# Altium schematic sheet [03] Arduino.SchDoc: Arduino Uno socket
size B; DocumentNumber: 3; SheetNumber: 3; SheetTotal: 3; Designators: 1-99; PageSize: B
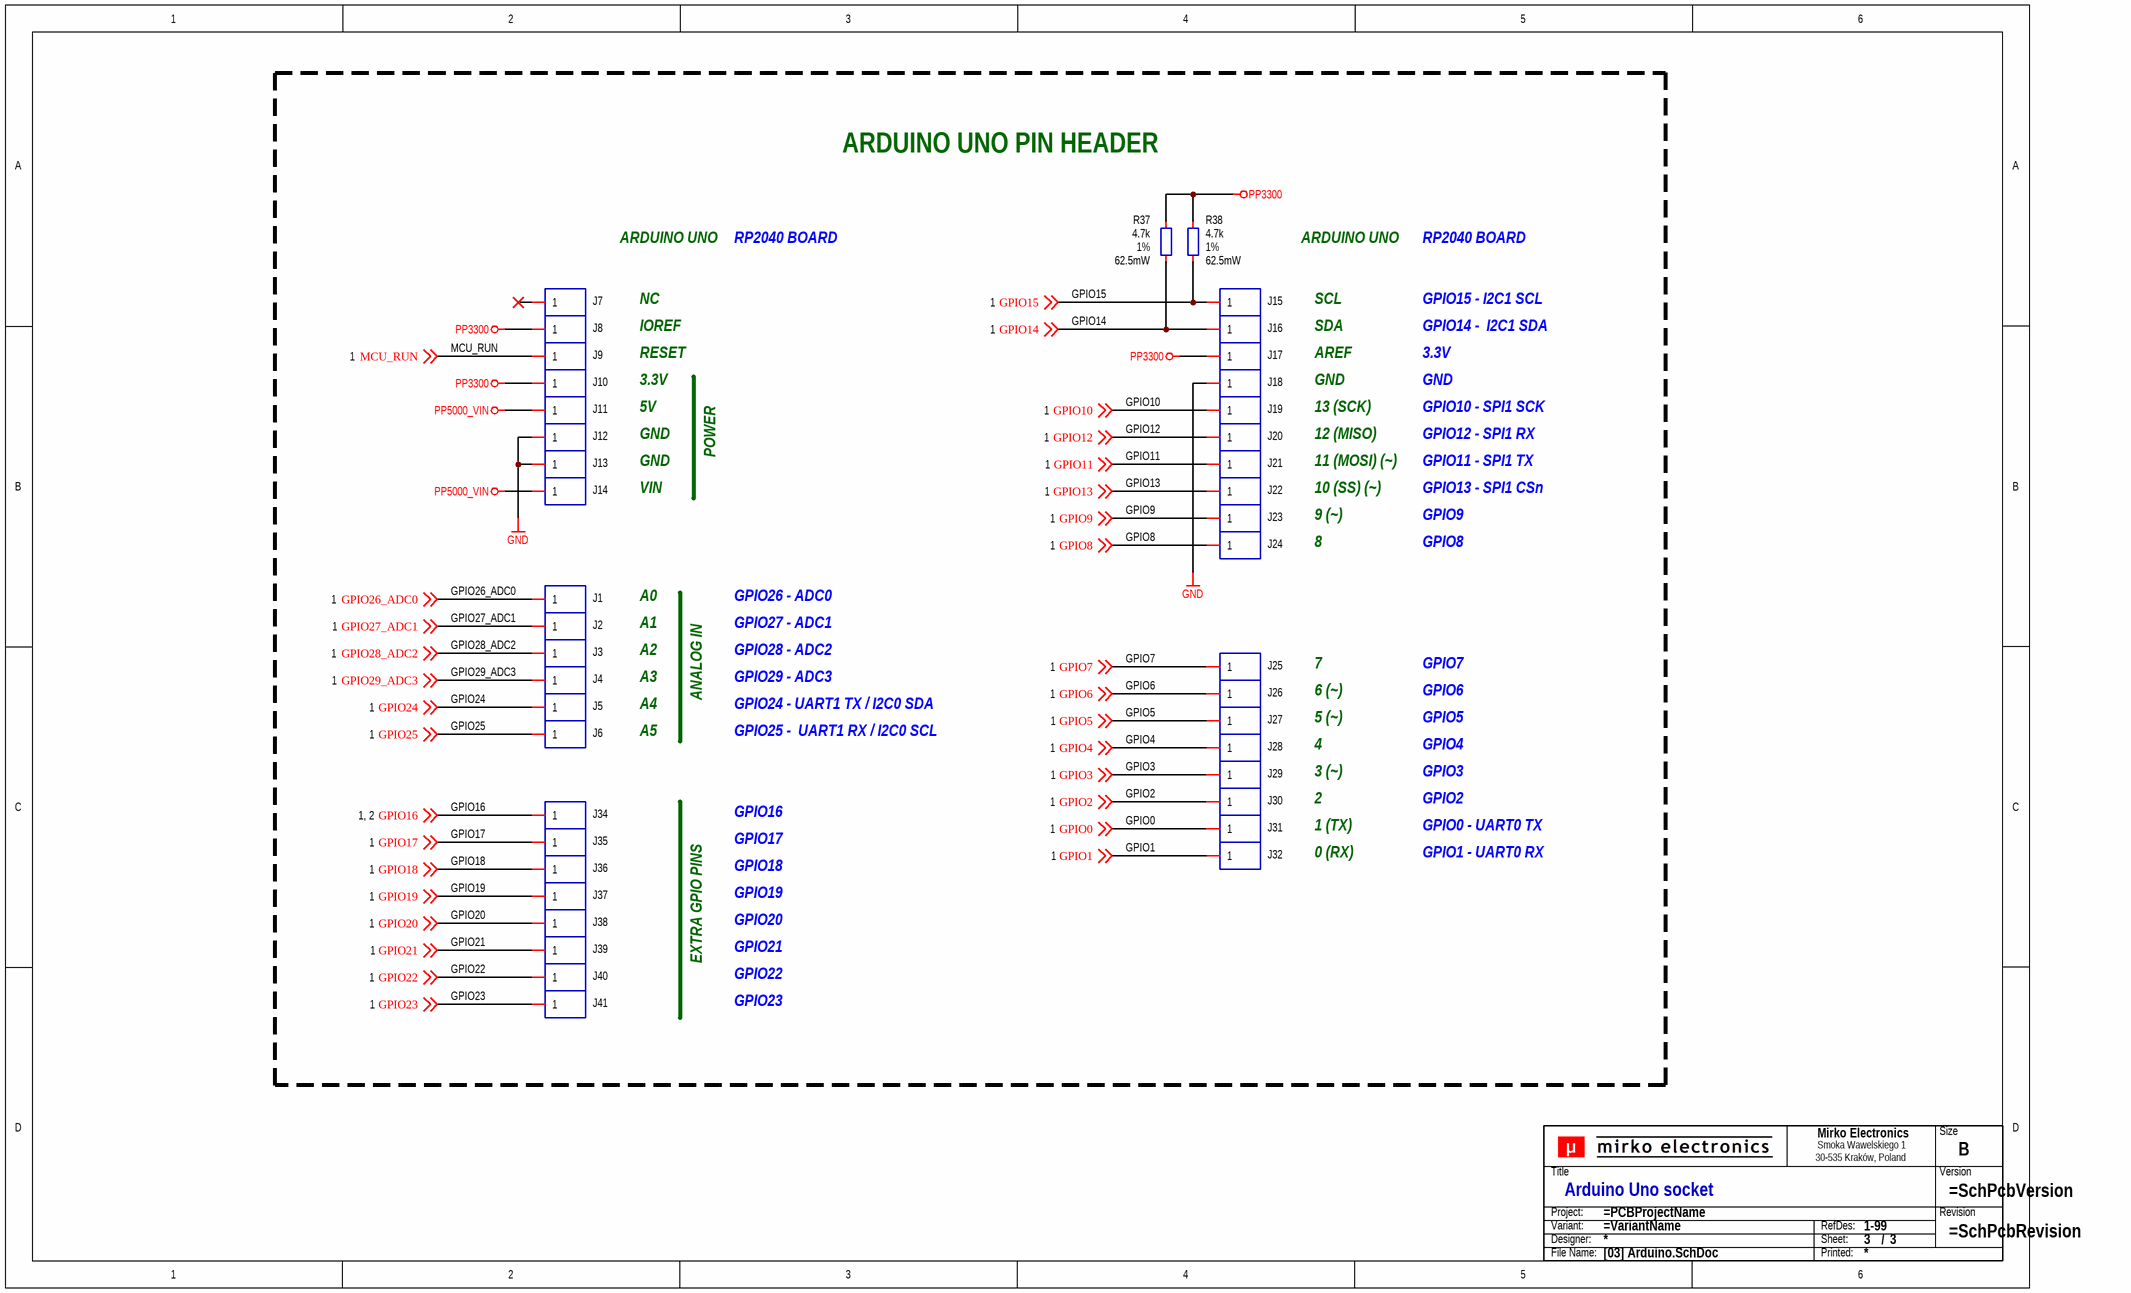
[diagram p0: [03] Arduino.SchDoc]

## Parts
J1  (no value)  [PCB_PAD_THT_280X180H100_RND]  (no BOM)
J2  (no value)  [PCB_PAD_THT_280X180H100_RND]  (no BOM)
J3  (no value)  [PCB_PAD_THT_280X180H100_RND]  (no BOM)
J4  (no value)  [PCB_PAD_THT_280X180H100_RND]  (no BOM)
J5  (no value)  [PCB_PAD_THT_280X180H100_RND]  (no BOM)
J6  (no value)  [PCB_PAD_THT_280X180H100_RND]  (no BOM)
J7  (no value)  [PCB_PAD_THT_280X180H100_RND]  (no BOM)
J8  (no value)  [PCB_PAD_THT_280X180H100_RND]  (no BOM)
J9  (no value)  [PCB_PAD_THT_280X180H100_RND]  (no BOM)
J10  (no value)  [PCB_PAD_THT_280X180H100_RND]  (no BOM)
J11  (no value)  [PCB_PAD_THT_280X180H100_RND]  (no BOM)
J12  (no value)  [PCB_PAD_THT_280X180H100_RND]  (no BOM)
J13  (no value)  [PCB_PAD_THT_280X180H100_RND]  (no BOM)
J14  (no value)  [PCB_PAD_THT_280X180H100_RND]  (no BOM)
J15  (no value)  [PCB_PAD_THT_280X180H100_RND]  (no BOM)
J16  (no value)  [PCB_PAD_THT_280X180H100_RND]  (no BOM)
J17  (no value)  [PCB_PAD_THT_280X180H100_RND]  (no BOM)
J18  (no value)  [PCB_PAD_THT_280X180H100_RND]  (no BOM)
J19  (no value)  [PCB_PAD_THT_280X180H100_RND]  (no BOM)
J20  (no value)  [PCB_PAD_THT_280X180H100_RND]  (no BOM)
J21  (no value)  [PCB_PAD_THT_280X180H100_RND]  (no BOM)
J22  (no value)  [PCB_PAD_THT_280X180H100_RND]  (no BOM)
J23  (no value)  [PCB_PAD_THT_280X180H100_RND]  (no BOM)
J24  (no value)  [PCB_PAD_THT_280X180H100_RND]  (no BOM)
J25  (no value)  [PCB_PAD_THT_280X180H100_RND]  (no BOM)
J26  (no value)  [PCB_PAD_THT_280X180H100_RND]  (no BOM)
J27  (no value)  [PCB_PAD_THT_280X180H100_RND]  (no BOM)
J28  (no value)  [PCB_PAD_THT_280X180H100_RND]  (no BOM)
J29  (no value)  [PCB_PAD_THT_280X180H100_RND]  (no BOM)
J30  (no value)  [PCB_PAD_THT_280X180H100_RND]  (no BOM)
J31  (no value)  [PCB_PAD_THT_280X180H100_RND]  (no BOM)
J32  (no value)  [PCB_PAD_THT_280X180H100_RND]  (no BOM)
J34  (no value)  [PCB_PAD_THT_280X180H100_RND]  (no BOM)
J35  (no value)  [PCB_PAD_THT_280X180H100_RND]  (no BOM)
J36  (no value)  [PCB_PAD_THT_280X180H100_RND]  (no BOM)
J37  (no value)  [PCB_PAD_THT_280X180H100_RND]  (no BOM)
J38  (no value)  [PCB_PAD_THT_280X180H100_RND]  (no BOM)
J39  (no value)  [PCB_PAD_THT_280X180H100_RND]  (no BOM)
J40  (no value)  [PCB_PAD_THT_280X180H100_RND]  (no BOM)
J41  (no value)  [PCB_PAD_THT_280X180H100_RND]  (no BOM)
R37  4.7k  Tolerance: 1%  Power Rating: 62.5mW  [RES_0402_R]
R38  4.7k  Tolerance: 1%  Power Rating: 62.5mW  [RES_0402_R]
TB?  Title block  (value not drawn)  (graphical)

## Blocks framed on the sheet
ARDUINO UNO PIN HEADER: J1-J32 J34-J41 R37 R38

## Nets
GND: J12.1 J13.1 J18.1
PP3300: J8.1 J10.1 J17.1 R37.2 R38.2
PP5000_VIN: J11.1 J14.1
GPIO0: J31.1 ; off-sheet GPIO0
GPIO1: J32.1 ; off-sheet GPIO1
GPIO2: J30.1 ; off-sheet GPIO2
GPIO3: J29.1 ; off-sheet GPIO3
GPIO4: J28.1 ; off-sheet GPIO4
GPIO5: J27.1 ; off-sheet GPIO5
GPIO6: J26.1 ; off-sheet GPIO6
GPIO7: J25.1 ; off-sheet GPIO7
GPIO8: J24.1 ; off-sheet GPIO8
GPIO9: J23.1 ; off-sheet GPIO9
GPIO10: J19.1 ; off-sheet GPIO10
GPIO11: J21.1 ; off-sheet GPIO11
GPIO12: J20.1 ; off-sheet GPIO12
GPIO13: J22.1 ; off-sheet GPIO13
GPIO14: J16.1 R37.1 ; off-sheet GPIO14
GPIO15: J15.1 R38.1 ; off-sheet GPIO15
GPIO16: J34.1 ; off-sheet GPIO16
GPIO17: J35.1 ; off-sheet GPIO17
GPIO18: J36.1 ; off-sheet GPIO18
GPIO19: J37.1 ; off-sheet GPIO19
GPIO20: J38.1 ; off-sheet GPIO20
GPIO21: J39.1 ; off-sheet GPIO21
GPIO22: J40.1 ; off-sheet GPIO22
GPIO23: J41.1 ; off-sheet GPIO23
GPIO24: J5.1 ; off-sheet GPIO24
GPIO25: J6.1 ; off-sheet GPIO25
GPIO26_ADC0: J1.1 ; off-sheet GPIO26_ADC0
GPIO27_ADC1: J2.1 ; off-sheet GPIO27_ADC1
GPIO28_ADC2: J3.1 ; off-sheet GPIO28_ADC2
GPIO29_ADC3: J4.1 ; off-sheet GPIO29_ADC3
MCU_RUN: J9.1 ; off-sheet MCU_RUN

Not connected (* = marked no-connect by the designer): J7 1*

## Notes on the sheet
- ARDUINO UNO
- RP2040 BOARD
- NC
- IOREF
- RESET
- SCL
- SDA
- AREF
- 3.3V
- GPIO14 -  I2C1 SDA
- GPIO15 - I2C1 SCL
- 5V
- GND
- 13 (SCK)
- GPIO10 - SPI1 SCK
- VIN
- POWER
- 12 (MISO)
- 11 (MOSI) (~)
- 10 (SS) (~)
- GPIO12 - SPI1 RX
- GPIO11 - SPI1 TX
- GPIO13 - SPI1 CSn
- 9 (~)
- 8
- GPIO9
- GPIO8
- A0
- A1
- GPIO26 - ADC0
- GPIO27 - ADC1
- A2
- A3
- ANALOG IN
- GPIO28 - ADC2
- GPIO29 - ADC3
- 6 (~)
- 7
- GPIO6
- GPIO7
- A4
- A5
- GPIO25 -  UART1 RX / I2C0 SCL
- GPIO24 - UART1 TX / I2C0 SDA
- 5 (~)
- 4
- 3 (~)
- GPIO5
- GPIO4
- GPIO3
- GPIO16
- 2
- 1 (TX)
- GPIO2
- GPIO0 - UART0 TX
- GPIO17
- GPIO18
- GPIO19
- 0 (RX)
- GPIO1 - UART0 RX
- EXTRA GPIO PINS
- GPIO20
- GPIO21
- GPIO22
- GPIO23
- (in symbol SCH_TITLE_BLOCK_V1) Mirko Electronics; Size; Smoka Wawelskiego 1; 30-535 Kraków, Poland; Title; Version; Project:; Revision; Variant:; RefDes:; Designer:; Sheet:; /; File Name:; Printed:

## Library data of the parts
J1-J32 J34-J41 = CON_1X01_COL: Connector; 1 Row;; Supplier 1: LCSC; Supplier 2: Farnell; Supplier 3: Mouser
R37 R38 = RES-0019: Resistor; Thick Film; 4.7k; 1%; 62.5mW; 100PPM; 50V; Standard; SMD; 0402 (1005);; Manufacturer: Yageo Corporation; MPN: RC0402FR-074K7L; Component Body: 1.00 x 0.50mm; Packaging Type: Tape & Reel; ID: RES-0019; Component Type: Resistor; Component Subtype: Thick Film; Value: 4.7k; Mounting Type: SMD; Package (Case): 0402 (1005); Component Height: 0.35mm; ROHS Status: RoHS Compliant; Operating Temperature: -55°C to +155°C; Resistance: 4.7k; TCR: 100PPM; Voltage Rating: 50V; Features: Standard; Supplier 1: LCSC; Supplier 2: Farnell; Supplier Part Number 1: C105871; Supplier Part Number 2: 9239316; Supplier 3: Mouser; Supplier Part Number 3: 603-RC0402FR-074K7L
TB? = SCH_TITLE_BLOCK_V1: Component Type: Title block; Manufacturer: -; Mounting Type: Non component; MPN: -; Operating Temperature: -; Package: -; Specification: Title block; Value: Title block; Replacement: -; System: ?